# EAGLE design noise-suppressor (EAGLE 5.08)
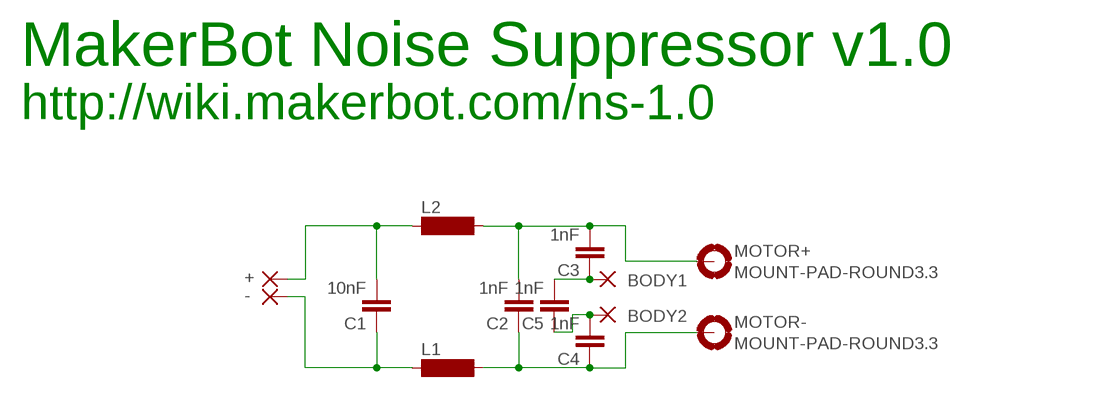
[diagram p0: schematic, sheet 1]

## Parts
+  SMD5  [SMD2,54-5,08]
-  SMD5  [SMD2,54-5,08]
BODY1  SMD5  [SMD2,54-5,08]
BODY2  SMD5  [SMD2,54-5,08]
C1  10nF  C-EUC1206  [C1206]
C2  1nF  C-EUC1206  [C1206]
C3  1nF  C-EUC1206  [C1206]
C4  1nF  C-EUC1206  [C1206]
C5  1nF  C-EUC1206  [C1206]
L1  SM-1206  [SM-1206]
L2  SM-1206  [SM-1206]
MOTOR+  MOUNT-PAD-ROUND3.3  [3,3-PAD]
MOTOR-  MOUNT-PAD-ROUND3.3  [3,3-PAD]

## Nets
N$1: +.1(P) C1.2 L2.1
N$2: -.1(P) C1.1 L1.1
N$3: C2.2 C3.2 L2.2 MOTOR+.B3,3(MOUNT)
N$4: BODY2.1(P) C4.2 C5.1
N$5: C2.1 C4.1 L1.2 MOTOR-.B3,3(MOUNT)
N$6: BODY1.1(P) C3.1 C5.2

## Notes on the sheet
- MakerBot Noise Suppressor v1.0
- http://wiki.makerbot.com/ns-1.0

## Library data of the parts
+ - BODY1 BODY2 = wirepad:SMD5: SMD PAD
C1-C5 = rcl:C-EU: CAPACITOR, European symbol
L1 L2 = inductor-neosid:SM-1206: INDUCTOR SMD chip inductor
MOTOR+ MOTOR- = holes:MOUNT-PAD-ROUND: MOUNTING PAD, round

## Net classes
0 default: width 1.676 mm, clearance 0.406 mm

## Board
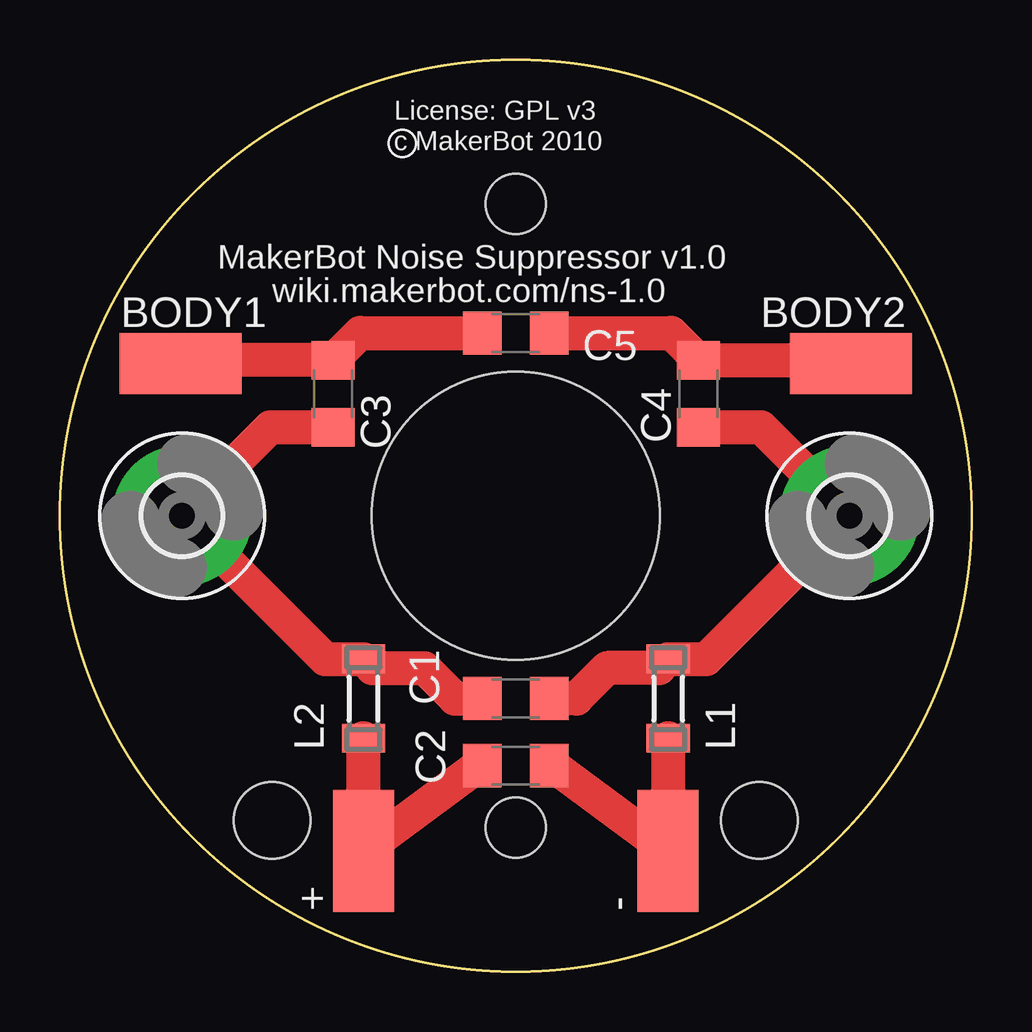
[diagram p1: board, top side]
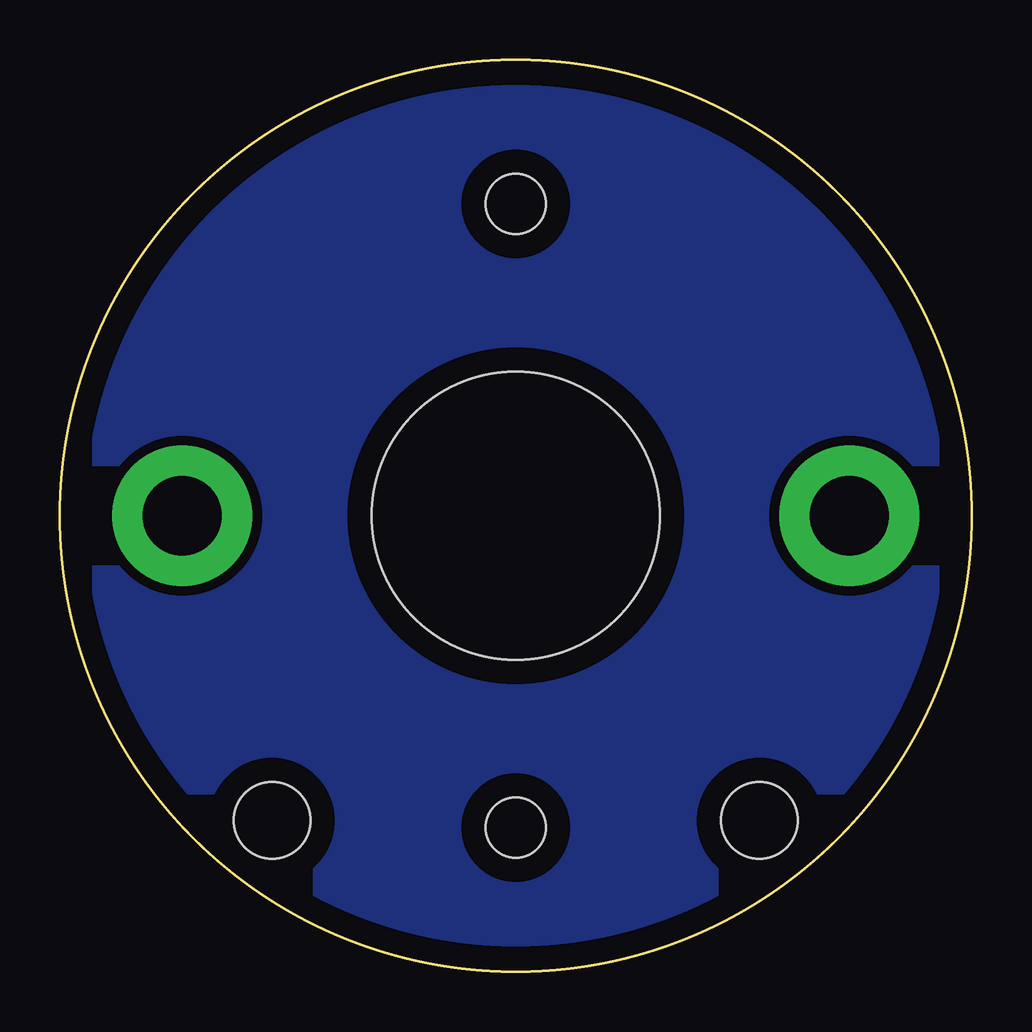
[diagram p2: board, bottom side, seen from below]

Size 38 x 38 mm. Coordinates in mm from the lower left corner, seen from the top.
Outline: circle at 19,19 radius 19
Copper layers (1*16): Top 0.035mm / dielectric 1.5mm / Bottom 0.035mm
Design rules "default": minimum track width 10mil, minimum drill 24mil, track to track 8mil, track to pad 8mil, pad to pad 8mil, via to via 8mil, smd to smd 8mil, copper to edge 40mil, drill to drill 8mil, minimum pad ring 10mil, minimum via ring 8mil, stop-mask expansion 4mil, vias tented up to drill 0mil, thermal gap 10mil
Holes 2.5 mm at 19,6 19,32
Holes 3.2 mm at 8.84,6.3 29.16,6.3
Holes 12 mm at 19,19

### Footprints (pad centres in the part's own frame; a part is rotated, then mirrored left to right if it is on the bottom)
SMD2,54-5,08 = smd 2.54 x 5.08: 1 0,0
C1206 = smd 1.6 x 1.8: 1 -1.4,0; 2 1.4,0
SM-1206 = smd 1.2 x 1.8: 1 -1.65,0; 2 1.65,0
3,3-PAD = drill 3.3 pad 5.842 round: B3,3 0,0

### Placement (x,y rotation side)
+  12.65,5.03 0 top
-  25.35,5.03 0 top
BODY1  5.03,25.35 270 top
BODY2  32.97,25.35 90 top
C1  19,8.59 180 top
C2  19,11.38 180 top
C3  11.38,24.08 270 top
C4  26.62,24.08 90 top
C5  19,26.62 180 top
L1  25.35,11.38 90 top
L2  12.65,11.38 90 top
MOTOR+  5.09,19 0 top
MOTOR-  32.91,19 0 top

### Tracks (layer width: path | path; a pad name or v marks a point on that pad's centre or on a via)
GND
  pour Bottom: -0.05,19 1.22,25.35 3.76,30.43 6.3,32.97 10.11,35.51 12.65,36.78 16.46,38.05 19,38.05 21.54,38.05 25.35,36.78 27.89,35.51 31.7,32.97 34.24,30.43 35.51,27.89 36.78,25.35 38.05,19 36.78,12.65 34.24,7.57 31.7,5.03 27.89,2.49 25.35,1.22 19,-0.05 12.65,1.22 7.57,3.76 5.03,6.3 2.49,10.11 1.22,13.92
N$1
  Top 1.422: L2.1 +.1 17.48,8.59 C1.2
N$2
  Top 1.422: L1.1 -.1 20.52,8.59 C1.1
N$3
  Top 1.422: C3.2 8.77,22.68 MOTOR+.B3,3 11.06,13.03 L2.2 13.03,12.65 15.19,12.65 16.46,11.38 C2.2
N$4
  Top 1.422: BODY2.1 32.84,25.48 C4.2 25.48,26.62 C5.1
N$5
  Top 1.422: C4.1 29.23,22.68 MOTOR-.B3,3 26.94,13.03 L1.2 24.97,12.65 22.81,12.65 21.54,11.38 C2.1
N$6
  Top 1.422: BODY1.1 5.16,25.48 C3.1 12.52,26.62 C5.2

### Text on the board
tPlace: License: GPL v3 | c MakerBot 2010 | MakerBot Noise Suppressor v1.0 | wiki.makerbot.com/ns-1.0